# Altium schematic sheet NiXie_tube_clock.SchDoc
size A2
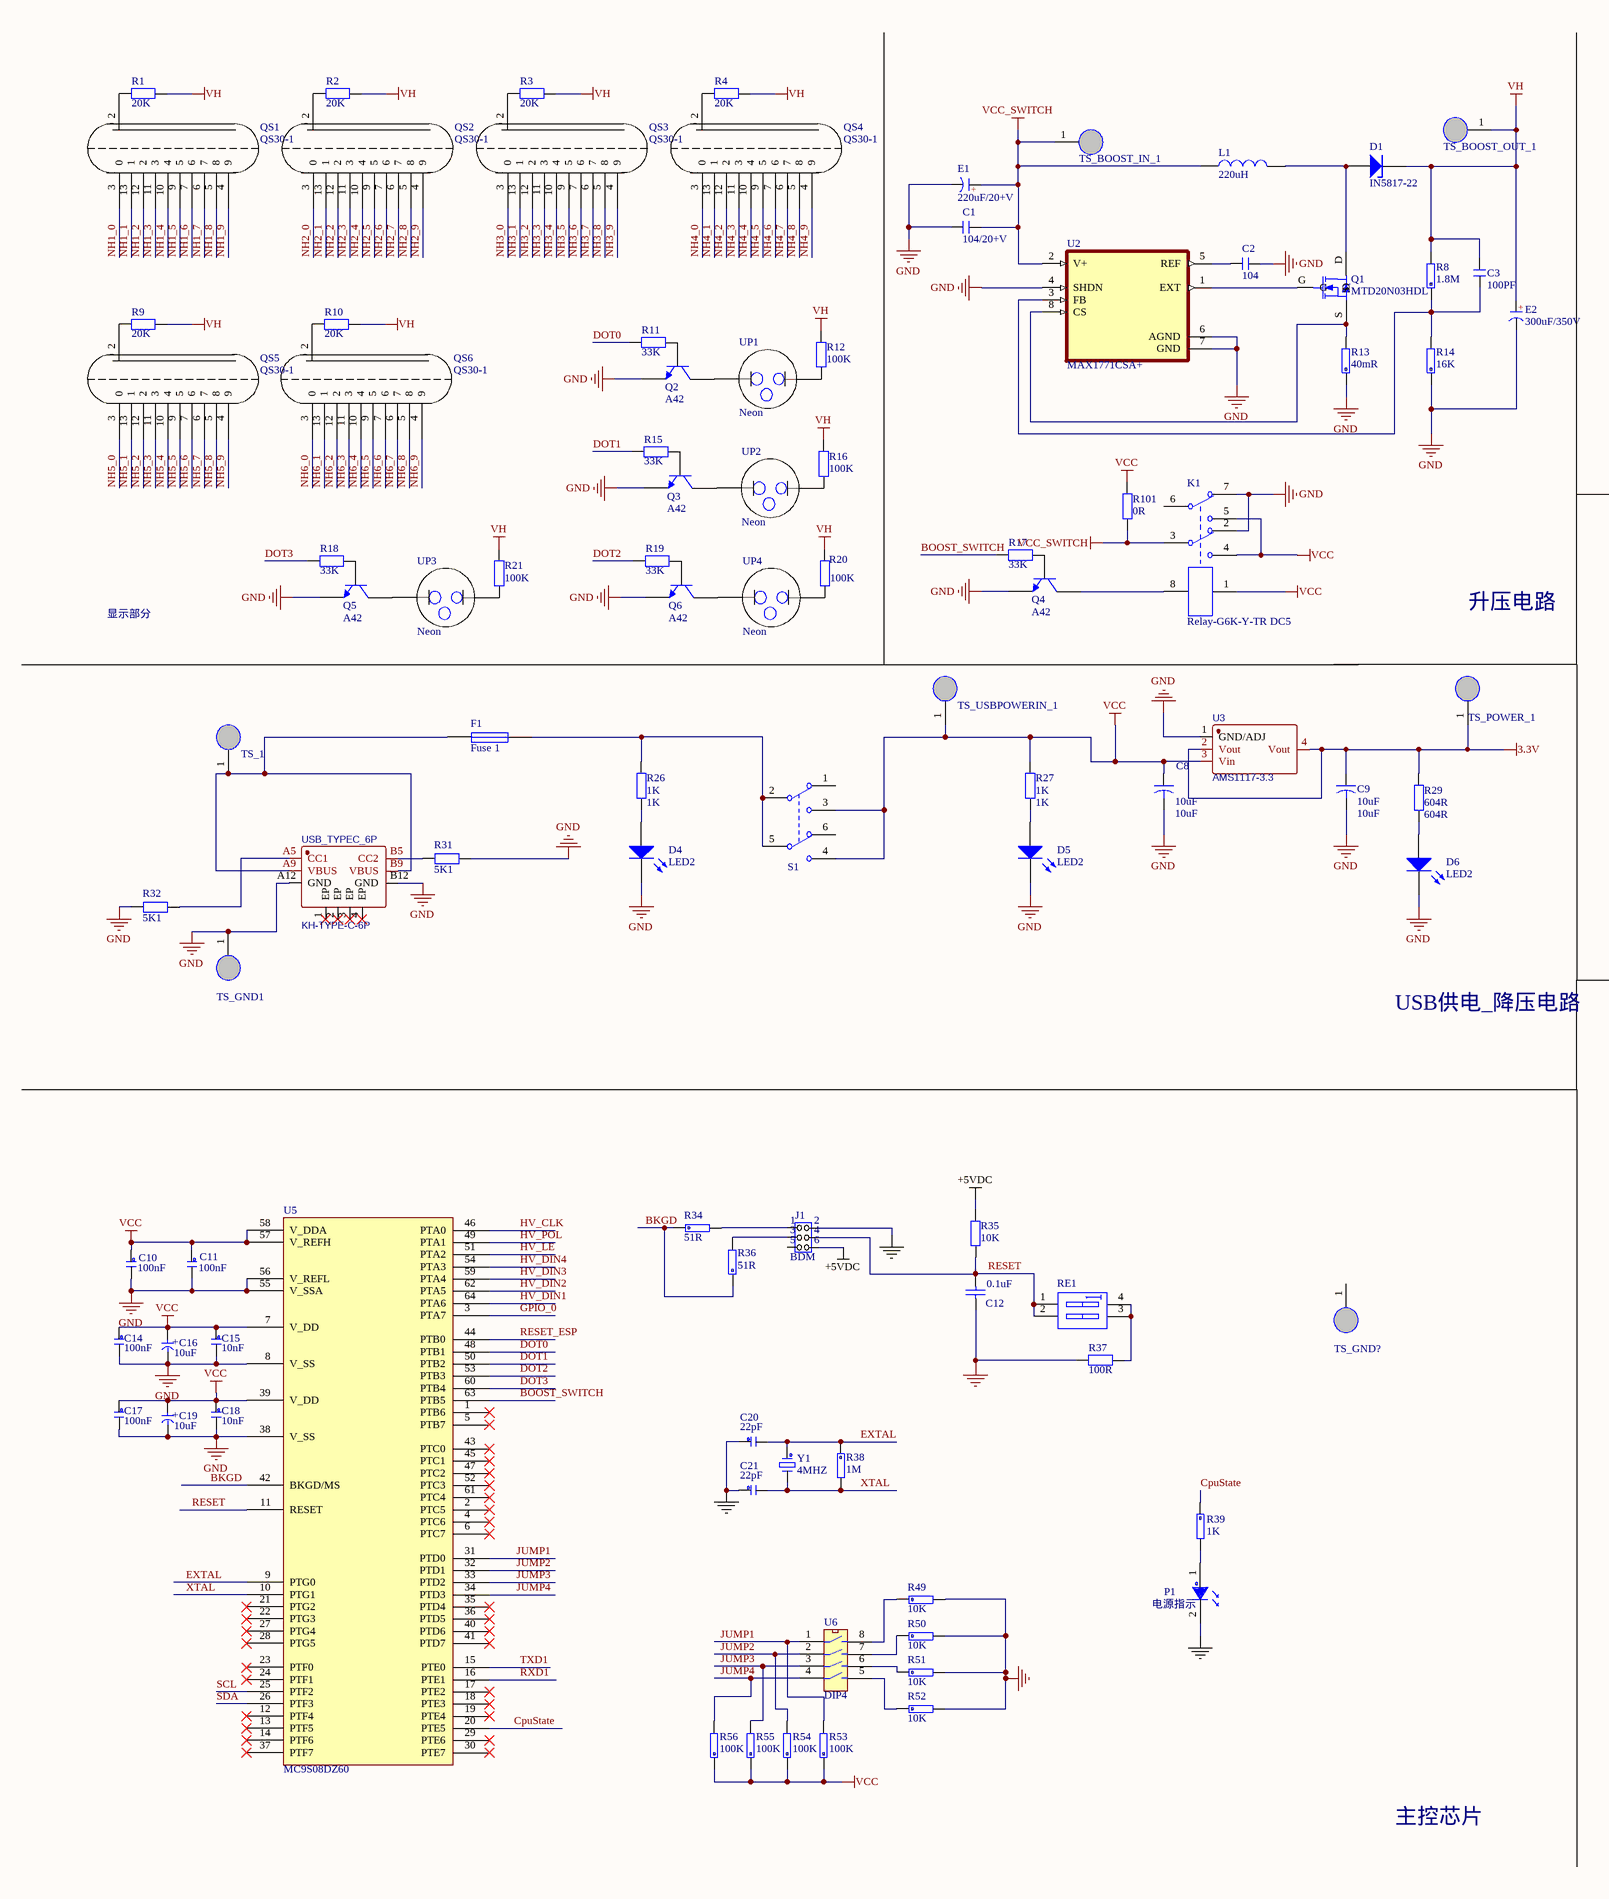
[diagram p0: NiXie_tube_clock.SchDoc, left]
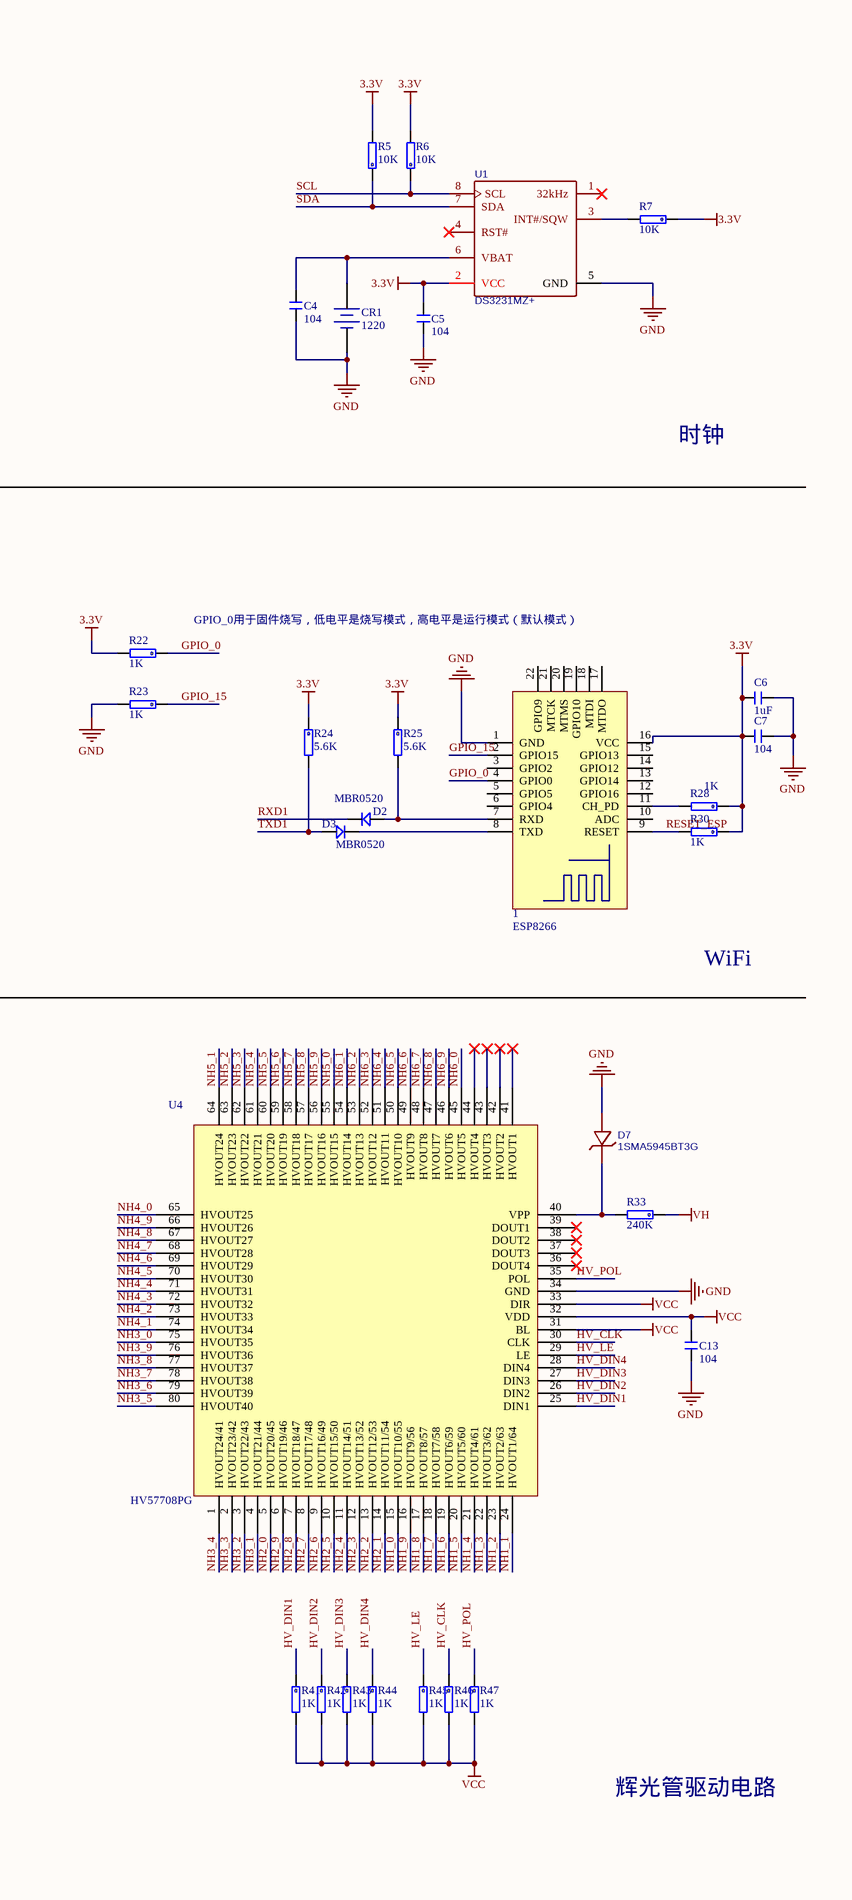
[diagram p1: NiXie_tube_clock.SchDoc, right]

## Parts
1  ESP8266  [ESP8266]
C1  104/20+V  [C 0805_L]
C2  104  [C 0805_L]
C3  100PF  [C 0805_L]
C4  104  [C 0805_L]
C5  104  [C 0805_L]
C6  1uF  [C 0805_L]
C7  104  [C 0805_L]
C8  10uF  [CD B(3528)]
C9  10uF  [CD B(3528)]
C10  100nF  [C0805]
C11  100nF  [C0805]
C12  0.1uF  [C0805]
C13  104  [C 0805_L]
C14  100nF  [C0805]
C15  10nF  [C0805]
C16  10uF  [CD B(3528)]
C17  100nF  [C0805]
C18  10nF  [C0805]
C19  10uF  [CD B(3528)]
C20  22pF  [C0805]
C21  22pF  [C0805]
CR1  1220  [CR1220_A]
D1  IN5817-22  [SOD-123]
D2  MBR0520  [SOD-123]
D3  MBR0520  [SOD-123]
D4  LED2  [LED 0805G]
D5  LED2  [LED 0805G]
D6  LED2  [LED 0805G]
D7  1SMA5945BT3G  [SMA]
E1  220uF/20+V  [CT 10*8 - C]
E2  300uF/350V  [CT 5*6 - C]
F1  Fuse 1  [FU 1206]
J1  BDM  [PIN6]
K1  Relay-G6K-Y-TR DC5  [G6K-2F]
L1  220uH  [CDRH129]
P1  电源指示  [LED 0805R]
Q1  MTD20N03HDL  [TO252]
Q2  A42  [SOT23]
Q3  A42  [SOT-23]
Q4  A42  [SOT-23]
Q5  A42  [SOT-23]
Q6  A42  [SOT-23]
QS1  QS30-1  [QS30-1]
QS2  QS30-1  [QS30-1]
QS3  QS30-1  [QS30-1]
QS4  QS30-1  [QS30-1]
QS5  QS30-1  [QS30-1]
QS6  QS30-1  [QS30-1]
R1  20K  [R 0805_L]
R2  20K  [R 0805_L]
R3  20K  [R 0805_L]
R4  20K  [R 0805_L]
R5  10K  [C0805]
R6  10K  [C0805]
R7  10K  [C0805]
R8  1.8M  [C0805]
R9  20K  [R 0805_L]
R10  20K  [R 0805_L]
R11  33K  [R 0805_L]
R12  100K  [R 0805_L]
R13  40mR  [C0805]
R14  16K  [C0805]
R15  33K  [R 0805_L]
R16  100K  [R 0805_L]
R17  33K  [R 0805_L]
R18  33K  [R 0805_L]
R19  33K  [R 0805_L]
R20  100K  [R 0805_L]
R21  100K  [R 0805_L]
R22  1K  [C0805]
R23  1K  [C0805]
R24  5.6K  [C0805]
R25  5.6K  [C0805]
R26  1K  [R 0805_L]
R27  1K  [R 0805_L]
R28  1K  [C0805]
R29  604R  [R 0805_L]
R30  1K  [C0805]
R31  5K1  [R 0805_M]
R32  5K1  [R 0805_M]
R33  240K  [C0805]
R34  51R  [C0805]
R35  10K  [C0805]
R36  51R  [C0805]
R37  100R  [C0805]
R38  1M  [C0805]
R39  1K  [C0805]
R41  1K  [C0805]
R42  1K  [C0805]
R43  1K  [C0805]
R44  1K  [C0805]
R45  1K  [C0805]
R46  1K  [C0805]
R47  1K  [C0805]
R49  10K  [C0805]
R50  10K  [C0805]
R51  10K  [C0805]
R52  10K  [C0805]
R53  100K  [C0805]
R54  100K  [C0805]
R55  100K  [C0805]
R56  100K  [C0805]
R101  0R  [R 0805_L]
RE1  SW DIP-2  [6MManjian]  (value not drawn)
S1  SK-22D02  [钮子开关6脚3档]  (value not drawn)
TS_1  12x16  [TP_ROUND]  (value not drawn)
TS_BOOST_IN_1  12x16  [TP_ROUND]  (value not drawn)
TS_BOOST_OUT_1  12x16  [TP_round]  (value not drawn)
TS_GND1  12x16  [TP_round]  (value not drawn)
TS_GND?  12x16  [ICO1]  (value not drawn)
TS_POWER_1  12x16  [TP_round]  (value not drawn)
TS_USBPOWERIN_1  12x16  [TP_round]  (value not drawn)
U1  DS3231MZ+  [SOIC-8]
U2  MAX1771CSA+  [SOIC-8]
U3  AMS1117-3.3  [SOT-223-3_L6.5-W3.4-P2.30-LS7.0-BR]
U4  HV57708PG  [QFP80P2390X1790X340-80N]
U5  MC9S08DZ60  [64-LQFP-10 - duplicate]
U6  DIP4  [DIP4C]
UP1  Neon  [Neon]
UP2  Neon  [Neon]
UP3  Neon  [Neon]
UP4  Neon  [Neon]
USB_TYPEC_6P  KH-TYPE-C-6P  [TYPE-C-SMD_TYPE-C-31-M-16]
Y1  4MHZ  [4M2P]

## Nets
3.3V: 1.16(VCC) C5.2 C6.1 C7.1 C9.1 R5.2 R6.2 R7.1 R22.2 R24.1 R25.1 R28.1 R29.1 R30.1 TS_POWER_1.1 U1.2(VCC) U3.2(Vout) U3.4(Vout)
+5VDC: J1.6 R35.2
GND: 1.1(GND) C1.2 C2.1 C4.1 C5.1 C6.2 C7.2 C8.2 C9.2 C10.2 C11.2 C12.1 C13.1 C14.2 C15.2 C16.2 C17.2 C18.2 C19.2 C20.1 C21.1 CR1.2(DC-) D4.2(K) D5.2(K) D6.2(K) D7.2(A) E1.2(K) E2.2(K) J1.2 K1.2 K1.7 P1.2 Q2.2(E) Q3.2(E) Q4.2(E) Q5.2(E) Q6.2(E) R13.1 R14.1 R23.2 R31.2 R32.1 R37.2 R49.2 R50.2 R51.2 R52.2 TS_GND1.1 U1.5(GND) U2.4(SHDN) U2.6(AGND) U2.7(GND) U3.1(GND/ADJ) U4.34(GND) U5.8(V_SS) U5.38(V_SS) U5.55(V_SSA) U5.56(V_REFL) USB_TYPEC_6P.A12(GND) USB_TYPEC_6P.B12(GND)
VCC: C8.1 C10.1 C11.1 C13.2 C14.1 C15.1 C16.1 C17.1 C18.1 C19.1 K1.1 K1.4 K1.5 R27.1 R41.2 R42.2 R43.2 R44.2 R45.2 R46.2 R47.2 R53.1 R54.1 R55.1 R56.1 R101.2 S1.3 S1.4 TS_USBPOWERIN_1.1 U3.3(Vin) U4.31(BL) U4.32(VDD) U4.33(DIR) U5.7(V_DD) U5.39(V_DD) U5.57(V_REFH) U5.58(V_DDA)
VCC_SWITCH: C1.1 E1.1(A) K1.3 L1.1 R101.1 TS_BOOST_IN_1.1 U2.2(V+)
VH: C3.2 D1.2(K) E2.1(A) R1.2 R2.2 R3.2 R4.2 R8.2 R9.2 R10.2 R12.1 R16.1 R20.1 R21.1 R33.1 TS_BOOST_OUT_1.1
BKGD: R34.1 R36.1 U5.42(BKGD/MS)
BOOST_SWITCH: R17.1 U5.63(PTB5)
CpuState: R39.1 U5.20(PTE5)
DOT0: R11.1 U5.48(PTB1)
DOT1: R15.1 U5.50(PTB2)
DOT2: R19.1 U5.53(PTB3)
DOT3: R18.1 U5.60(PTB4)
EXTAL: C20.2 R38.1 U5.9(PTG0) Y1.1
GPIO_0: 1.4(GPIO0) R22.1 U5.3(PTA7)
GPIO_15: 1.2(GPIO15) R23.1
HV_CLK: R46.1 U4.30(CLK) U5.46(PTA0)
HV_DIN1: R41.1 U4.25(DIN1) U5.64(PTA6)
HV_DIN2: R42.1 U4.26(DIN2) U5.62(PTA5)
HV_DIN3: R43.1 U4.27(DIN3) U5.59(PTA4)
HV_DIN4: R44.1 U4.28(DIN4) U5.54(PTA3)
HV_LE: R45.1 U4.29(LE) U5.51(PTA2)
HV_POL: R47.1 U4.35(POL) U5.49(PTA1)
JUMP1: R53.2 U5.31(PTD0) U6.1
JUMP2: R54.2 U5.32(PTD1) U6.2
JUMP3: R55.2 U5.33(PTD2) U6.3
JUMP4: R56.2 U5.34(PTD3) U6.4
NH1_0: QS1.3(0) U4.15(HVOUT10/55)
NH1_1: QS1.13(1) U4.24(HVOUT1/64)
NH1_2: QS1.12(2) U4.23(HVOUT2/63)
NH1_3: QS1.11(3) U4.22(HVOUT3/62)
NH1_4: QS1.10(4) U4.21(HVOUT4/61)
NH1_5: QS1.9(5) U4.20(HVOUT5/60)
NH1_6: QS1.7(6) U4.19(HVOUT6/59)
NH1_7: QS1.6(7) U4.18(HVOUT7/58)
NH1_8: QS1.5(8) U4.17(HVOUT8/57)
NH1_9: QS1.4(9) U4.16(HVOUT9/56)
NH2_0: QS2.3(0) U4.5(HVOUT20/45)
NH2_1: QS2.13(1) U4.14(HVOUT11/54)
NH2_2: QS2.12(2) U4.13(HVOUT12/53)
NH2_3: QS2.11(3) U4.12(HVOUT13/52)
NH2_4: QS2.10(4) U4.11(HVOUT14/51)
NH2_5: QS2.9(5) U4.10(HVOUT15/50)
NH2_6: QS2.7(6) U4.9(HVOUT16/49)
NH2_7: QS2.6(7) U4.8(HVOUT17/48)
NH2_8: QS2.5(8) U4.7(HVOUT18/47)
NH2_9: QS2.4(9) U4.6(HVOUT19/46)
NH3_0: QS3.3(0) U4.75(HVOUT35)
NH3_1: QS3.13(1) U4.4(HVOUT21/44)
NH3_2: QS3.12(2) U4.3(HVOUT22/43)
NH3_3: QS3.11(3) U4.2(HVOUT23/42)
NH3_4: QS3.10(4) U4.1(HVOUT24/41)
NH3_5: QS3.9(5) U4.80(HVOUT40)
NH3_6: QS3.7(6) U4.79(HVOUT39)
NH3_7: QS3.6(7) U4.78(HVOUT38)
NH3_8: QS3.5(8) U4.77(HVOUT37)
NH3_9: QS3.4(9) U4.76(HVOUT36)
NH4_0: QS4.3(0) U4.65(HVOUT25)
NH4_1: QS4.13(1) U4.74(HVOUT34)
NH4_2: QS4.12(2) U4.73(HVOUT33)
NH4_3: QS4.11(3) U4.72(HVOUT32)
NH4_4: QS4.10(4) U4.71(HVOUT31)
NH4_5: QS4.9(5) U4.70(HVOUT30)
NH4_6: QS4.7(6) U4.69(HVOUT29)
NH4_7: QS4.6(7) U4.68(HVOUT28)
NH4_8: QS4.5(8) U4.67(HVOUT27)
NH4_9: QS4.4(9) U4.66(HVOUT26)
NH5_0: QS5.3(0) U4.55(HVOUT15)
NH5_1: QS5.13(1) U4.64(HVOUT24)
NH5_2: QS5.12(2) U4.63(HVOUT23)
NH5_3: QS5.11(3) U4.62(HVOUT22)
NH5_4: QS5.10(4) U4.61(HVOUT21)
NH5_5: QS5.9(5) U4.60(HVOUT20)
NH5_6: QS5.7(6) U4.59(HVOUT19)
NH5_7: QS5.6(7) U4.58(HVOUT18)
NH5_8: QS5.5(8) U4.57(HVOUT17)
NH5_9: QS5.4(9) U4.56(HVOUT16)
NH6_0: QS6.3(0) U4.45(HVOUT5)
NH6_1: QS6.13(1) U4.54(HVOUT14)
NH6_2: QS6.12(2) U4.53(HVOUT13)
NH6_3: QS6.11(3) U4.52(HVOUT12)
NH6_4: QS6.10(4) U4.51(HVOUT11)
NH6_5: QS6.9(5) U4.50(HVOUT10)
NH6_6: QS6.7(6) U4.49(HVOUT9)
NH6_7: QS6.6(7) U4.48(HVOUT8)
NH6_8: QS6.5(8) U4.47(HVOUT7)
NH6_9: QS6.4(9) U4.46(HVOUT6)
RESET: C12.2 J1.4 R35.1 RE1.1(A1) RE1.2(A2) U5.11(RESET)
RESET_ESP: 1.9(RESET) R30.2 U5.44(PTB0)
RXD1: D2.2 U5.16(PTE1)
SCL: R6.1 U1.8(SCL) U5.25(PTF2)
SDA: R5.1 U1.7(SDA) U5.26(PTF3)
TXD1: D3.1 R24.2 U5.15(PTE0)
XTAL: C21.2 R38.2 U5.10(PTG1) Y1.2
Net1_7: 1.7(RXD) D2.1 R25.2
Net1_8: 1.8(TXD) D3.2
Net1_11: 1.11(CH_PD) R28.2
NetC2_2: C2.2 U2.5(REF)
NetC3_1: C3.1 R8.1 R14.2 U2.3(FB)
NetC4_2: C4.2 CR1.1(DC+) U1.6(VBAT)
NetD1_1: D1.1(A) L1.2 Q1.D
NetD4_1: D4.1(A) R26.2
NetD5_1: D5.1(A) R27.2
NetD6_1: D6.1(A) R29.2
NetD7_1: D7.1(K) R33.2 U4.40(VPP)
NetF1_1: F1.1 TS_1.1 USB_TYPEC_6P.A9(VBUS) USB_TYPEC_6P.B9(VBUS)
NetF1_2: F1.2 R26.1 S1.2 S1.5
NetJ1_1: J1.1 R34.2
NetJ1_3: J1.3 R36.2
NetK1_8: K1.8 Q4.3(C)
NetP1_1: P1.1 R39.2
NetQ1_G: Q1.G U2.1(EXT)
NetQ1_S: Q1.S R13.2 U2.8(CS)
NetQ2_1: Q2.1(B) R11.2
NetQ2_3: Q2.3(C) UP1.2
NetQ3_1: Q3.1(B) R15.2
NetQ3_3: Q3.3(C) UP2.2
NetQ4_1: Q4.1(B) R17.2
NetQ5_1: Q5.1(B) R18.2
NetQ5_3: Q5.3(C) UP3.2
NetQ6_1: Q6.1(B) R19.2
NetQ6_3: Q6.3(C) UP4.2
NetQS1_2: QS1.2 R1.1
NetQS2_2: QS2.2 R2.1
NetQS3_2: QS3.2 R3.1
NetQS4_2: QS4.2 R4.1
NetQS5_2: QS5.2 R9.1
NetQS6_2: QS6.2 R10.1
NetR7_2: R7.2 U1.3(INT#/SQW)
NetR12_2: R12.2 UP1.1
NetR16_2: R16.2 UP2.1
NetR20_2: R20.2 UP4.1
NetR21_2: R21.2 UP3.1
NetR31_1: R31.1 USB_TYPEC_6P.B5(CC2)
NetR32_2: R32.2 USB_TYPEC_6P.A5(CC1)
NetR37_1: R37.1 RE1.3(B2) RE1.4(B1)
NetR49_1: R49.1 U6.8
NetR50_1: R50.1 U6.7
NetR51_1: R51.1 U6.6
NetR52_1: R52.1 U6.5

Not connected (* = marked no-connect by the designer): 1 3(GPIO2) 5(GPIO5) 6(GPIO4) 10(ADC) 12(GPIO16) 13(GPIO14) 14(GPIO12) 15(GPIO13) 17(MTDO) 18(MTDI) 19(GPIO10) 20(MTMS) 21(MTCK) 22(GPIO9); J1 5; K1 6; S1 1 6; TS_GND? 1; U1 1(32kHz)* 4(RST#)*; U4 36(DOUT4)* 37(DOUT3)* 38(DOUT2)* 39(DOUT1)* 41(HVOUT1)* 42(HVOUT2)* 43(HVOUT3)* 44(HVOUT4)*; U5 1(PTB6)* 2(PTC5)* 4(PTC6)* 5(PTB7)* 6(PTC7)* 12(PTF4)* 13(PTF5)* 14(PTF6)* 17(PTE2)* 18(PTE3)* 19(PTE4)* 21(PTG2)* 22(PTG3)* 23(PTF0)* 24(PTF1)* 27(PTG4)* 28(PTG5)* 29(PTE6)* 30(PTE7)* 35(PTD4)* 36(PTD5)* 37(PTF7)* 40(PTD6)* 41(PTD7)* 43(PTC0)* 45(PTC1)* 47(PTC2)* 52(PTC3)* 61(PTC4)*; USB_TYPEC_6P 1(EP)* 2(EP)* 3(EP)* 4(EP)*

## Notes on the sheet
- 时钟
- 显示部分
- 升压电路
- (near R22) GPIO_0用于固件烧写，低电平是烧写模式，高电平是运行模式（默认模式）
- WiFi
- USB供电_降压电路
- 辉光管驱动电路
- 主控芯片
- (in symbol CS_SMD) +
- (in symbol ELE-CAP) +

## Library data of the parts
C1-C7 C13 = C: 贴片电容; BOM名称: 无极性贴片电容; 封装库来自淘宝卖家 ID：黄晶宝石: 其他店铺购入均为盗版假冒封装库; 技术支持，联系售后: 唯一出售店铺网址https://shop463601444.taobao.com
C8 C9 = Cap2: 钽电容; Published: 23-Sep-2002; PackageReference: CAPR5-4X5; Publisher: Altium Limited; PackageDescription: Capacitor; 2 Leads; Value: 10uF
C10 C11 C14 C15 C17 C18 C20 C21 = CAP
C12 = Cap: Capacitor; Published: 8-Jun-2000; LatestRevisionDate: 17-Jul-2002; LatestRevisionNote: Re-released for DXP Platform.; PackageReference: RAD-0.3; Publisher: Altium Limited; PackageDescription: Radial Cap, Thru-Hole; 2 Leads; 0.3 in Pin Spacing; Value: 0.1uF
C16 C19 = ELE-CAP
CR1 = CR-3V: 微型电池; 封装库来自淘宝卖家 ID：黄晶宝石: 其他店铺购入均为盗版，请立即申请退款，本店提供现金奖励; 免费技术支持，联系售后: 唯一出售店铺网址https://shop463601444.taobao.com; BOM名称: 微型电池
D1 = 稳压二极管: Zener Diode; 封装库来自淘宝卖家 ID：黄晶宝石: 其他店铺购入均为盗版假冒封装库; 技术支持，联系售后: 唯一出售店铺网址https://shop463601444.taobao.com
D2 D3 = D: 1N4148
D4-D6 = LED2: Typical RED, GREEN, YELLOW, AMBER GaAs LED; Published: 8-Jun-2000; LatestRevisionDate: 17-Jul-2002; LatestRevisionNote: Re-released for DXP Platform.; PackageVersion: Feb-2002; PackageReference: 3.2X1.6X1.1; Publisher: Altium Limited; PackageDescription: SM LED; 2 Flat Leads
D7 = 1SMA5931BT3G: BOM_Manufacturer: ON Semicon; Contributor: LCSC; SMT Type: Extend; BOM_Supplier: LCSC; BOM_Supplier Part: C94872; BOM_Manufacturer Part: 1SMA5931BT3G; BOM_LCSC Assembly: Yes; spicePre: D; spiceSymbolName: 1SMA5931BT3G
E1 E2 = CS_SMD: 贴片固态电容; 封装库来自淘宝卖家 ID：黄晶宝石: 其他店铺购入均为盗版假冒封装库; 技术支持，联系售后: 唯一出售店铺网址https://shop463601444.taobao.com; BOM名称: 贴片固态电容
F1 = Fuse 1: Fuse; Published: 8-Jun-2000; LatestRevisionDate: 17-Jul-2002; LatestRevisionNote: Re-released for DXP Platform.; PackageReference: PIN-W2/E2.8; Publisher: Altium Limited; PackageDescription: Thru-Hole; 2 Leads
K1 = Relay-G6K: Relay-G6K-2F DC12; Published: 24-Mar-1999; LatestRevisionDate: 17-Jul-2002; LatestRevisionNote: Re-released for DXP Platform.; PackageReference: DIP-P8; Publisher: Altium Limited; PackageDescription: Relay; 8 Leads
L1 = L: 小功率贴片电感; 封装库来自淘宝卖家 ID：黄晶宝石: 其他店铺购入均为盗版假冒封装库; 技术支持，联系售后: 唯一出售店铺网址https://shop463601444.taobao.com; BOM名称: 小功率贴片电感
P1 = LED
Q1 = MOSFET-N: N-Channel MOSFET; 封装库来自淘宝卖家 ID：黄晶宝石: 其他店铺购入均为假冒，请申请退款，本店现金奖励; 技术支持，联系售后: 唯一出售店铺网址https://shop463601444.taobao.com
Q2-Q6 = 2N3904: NPN General Purpose Amplifier; Published: 8-Jun-2000; LatestRevisionDate: 15-Jan-2003; LatestRevisionNote: PCB Footprint 'BCY-W3/D4.7' replaced; DatasheetVersion: 1997; PackageVersion: Sep-1998; PackageReference: TO-92A; Publisher: Altium Limited; PackageDescription: TO, Flat Index; 3 In-Line, Axial Leads; Body Dia. 4.5mm; Leads 0.51 x 0.48 mm (max); ComponentLink1Description: Manufacturer Link; ComponentLink1URL: http://www.fairchildsemi.com/; ComponentLink2Description: Datasheet; ComponentLink2URL: http://www.fairchildsemi.com/ds/2N%2F2N3904.pdf
R1-R4 R9-R12 R15-R21 R26 R27 R29 R35 R37 R101 = Res2: Resistor; Published: 8-Jun-2000; LatestRevisionDate: 17-Jul-2002; LatestRevisionNote: Re-released for DXP Platform.; PackageReference: AXIAL-0.4; Publisher: Altium Limited; PackageDescription: Axial Device, Thru-Hole; 2 Leads; 0.4 in Pin Spacing
  R1-R4 R9 R10: Value: 20K
  R11 R15 R17-R19: Value: 33K
  R12 R16 R20 R21: Value: 100K
  R26 R27: Value: 1K
  R29: Value: 604R
  R35: Value: 10K
  R37: Value: 100R
  R101: Value: 0R
R5-R8 R13 R14 R22-R25 R28 R30 R33 R34 R36 R38 R39 R41-R47 R49-R56 = RESISTANCE
R31 R32 = R: 贴片电阻; 封装库来自淘宝卖家 ID：黄晶宝石: 其他店铺购入均为盗版假冒封装库; 技术支持，联系售后: 唯一出售店铺网址https://shop463601444.taobao.com; BOM名称: 贴片电阻
RE1 = SW DIP-2: DIP Switch, 2 Position, SPST; Published: 24-Mar-1999; LatestRevisionDate: 17-Jul-2002; LatestRevisionNote: Re-released for DXP Platform.; PackageReference: DIP-4; Publisher: Altium Limited
S1 = SSW-2P: 2路波动开关; BOM名称: 波动开关; 免费技术支持，联系售后: 唯一出售店铺网址https://shop463601444.taobao.com; 封装库来自淘宝卖家 ID：黄晶宝石: 其他店铺购入均为盗版假冒封装库，请立即申请退款，本店3~10元现金奖励
TS_1 TS_BOOST_IN_1 TS_BOOST_OUT_1 TS_GND1 TS_GND? TS_POWER_1 TS_USBPOWERIN_1 = TTS: 触控弹簧; 免费技术支持，联系售后: 唯一出售店铺网址https://shop463601444.taobao.com; 封装库来自淘宝卖家 ID：黄晶宝石: 其他店铺购入均为盗版假冒封装库，请立即申请退款，本店3~10元现金奖励; BOM名称: 触控弹簧
U1 = DS3231MZ+: BOM_Manufacturer: MAXIM; BOM_Supplier: LCSC; BOM_Manufacturer Part: DS3231MZ+; BOM_Supplier Part: C107410; BOM_JLCPCB Part Class: Extended Part; spicePre: U; spiceSymbolName: DS3231MZ+
U2 = MAX1771CSA+: Boost, Buck-Boost Regulator Positive Output Step-Up, Step-Up/Step-Down DC-DC Controller IC 8-SOIC; MF: Maxim Integrated; Availability: Unavailable; SnapEDA_Link: https://www.snapeda.com/parts/MAX1771CSA+/Maxim%20Integrated/view-part/578827/?ref=snap; Price: None; Package: SOIC-8 Maxim; MP: MAX1771CSA+; Value: *
U3 = AMS1117-3.3: BOM_Manufacturer: AMS; sourceId: dwIGgezVh; SMT Type: Basic; timeStamp: 1476261164; BOM_Supplier: LCSC; BOM_Manufacturer Part: AMS1117-3.3; BOM_LCSC Assembly: Yes; image: //image.lceda.cn/szlcsc/C6186.jpg; BOM_Supplier Part: C6186; spicePre: U; spiceSymbolName: AMS1117-3.3
USB_TYPEC_6P = KH-TYPE-C-6P: BOM_Manufacturer: Shenzhen Kinghelm Elec; Contributor: LCSC; BOM_Supplier: LCSC; BOM_Supplier Part: C709355; BOM_Manufacturer Part: KH-TYPE-C-6P; BOM_JLCPCB Part Class: Extended Part; spicePre: U; spiceSymbolName: KH-TYPE-C-6P
Y1 = CRYSTAL